# Altium schematic sheet TOP.SchDoc
size 420 x 297 mm; Date: 22.03.2024; ApprovedBy: Arda B.; CheckedBy: Arda B.; DrawnBy: Arda Bozkurt; Revision: 001; SheetNumber: 3; SheetTotal: 9; Size: A3; Department: HDD; DOC_NO_ASSY_: __; Time: 22.03.2024
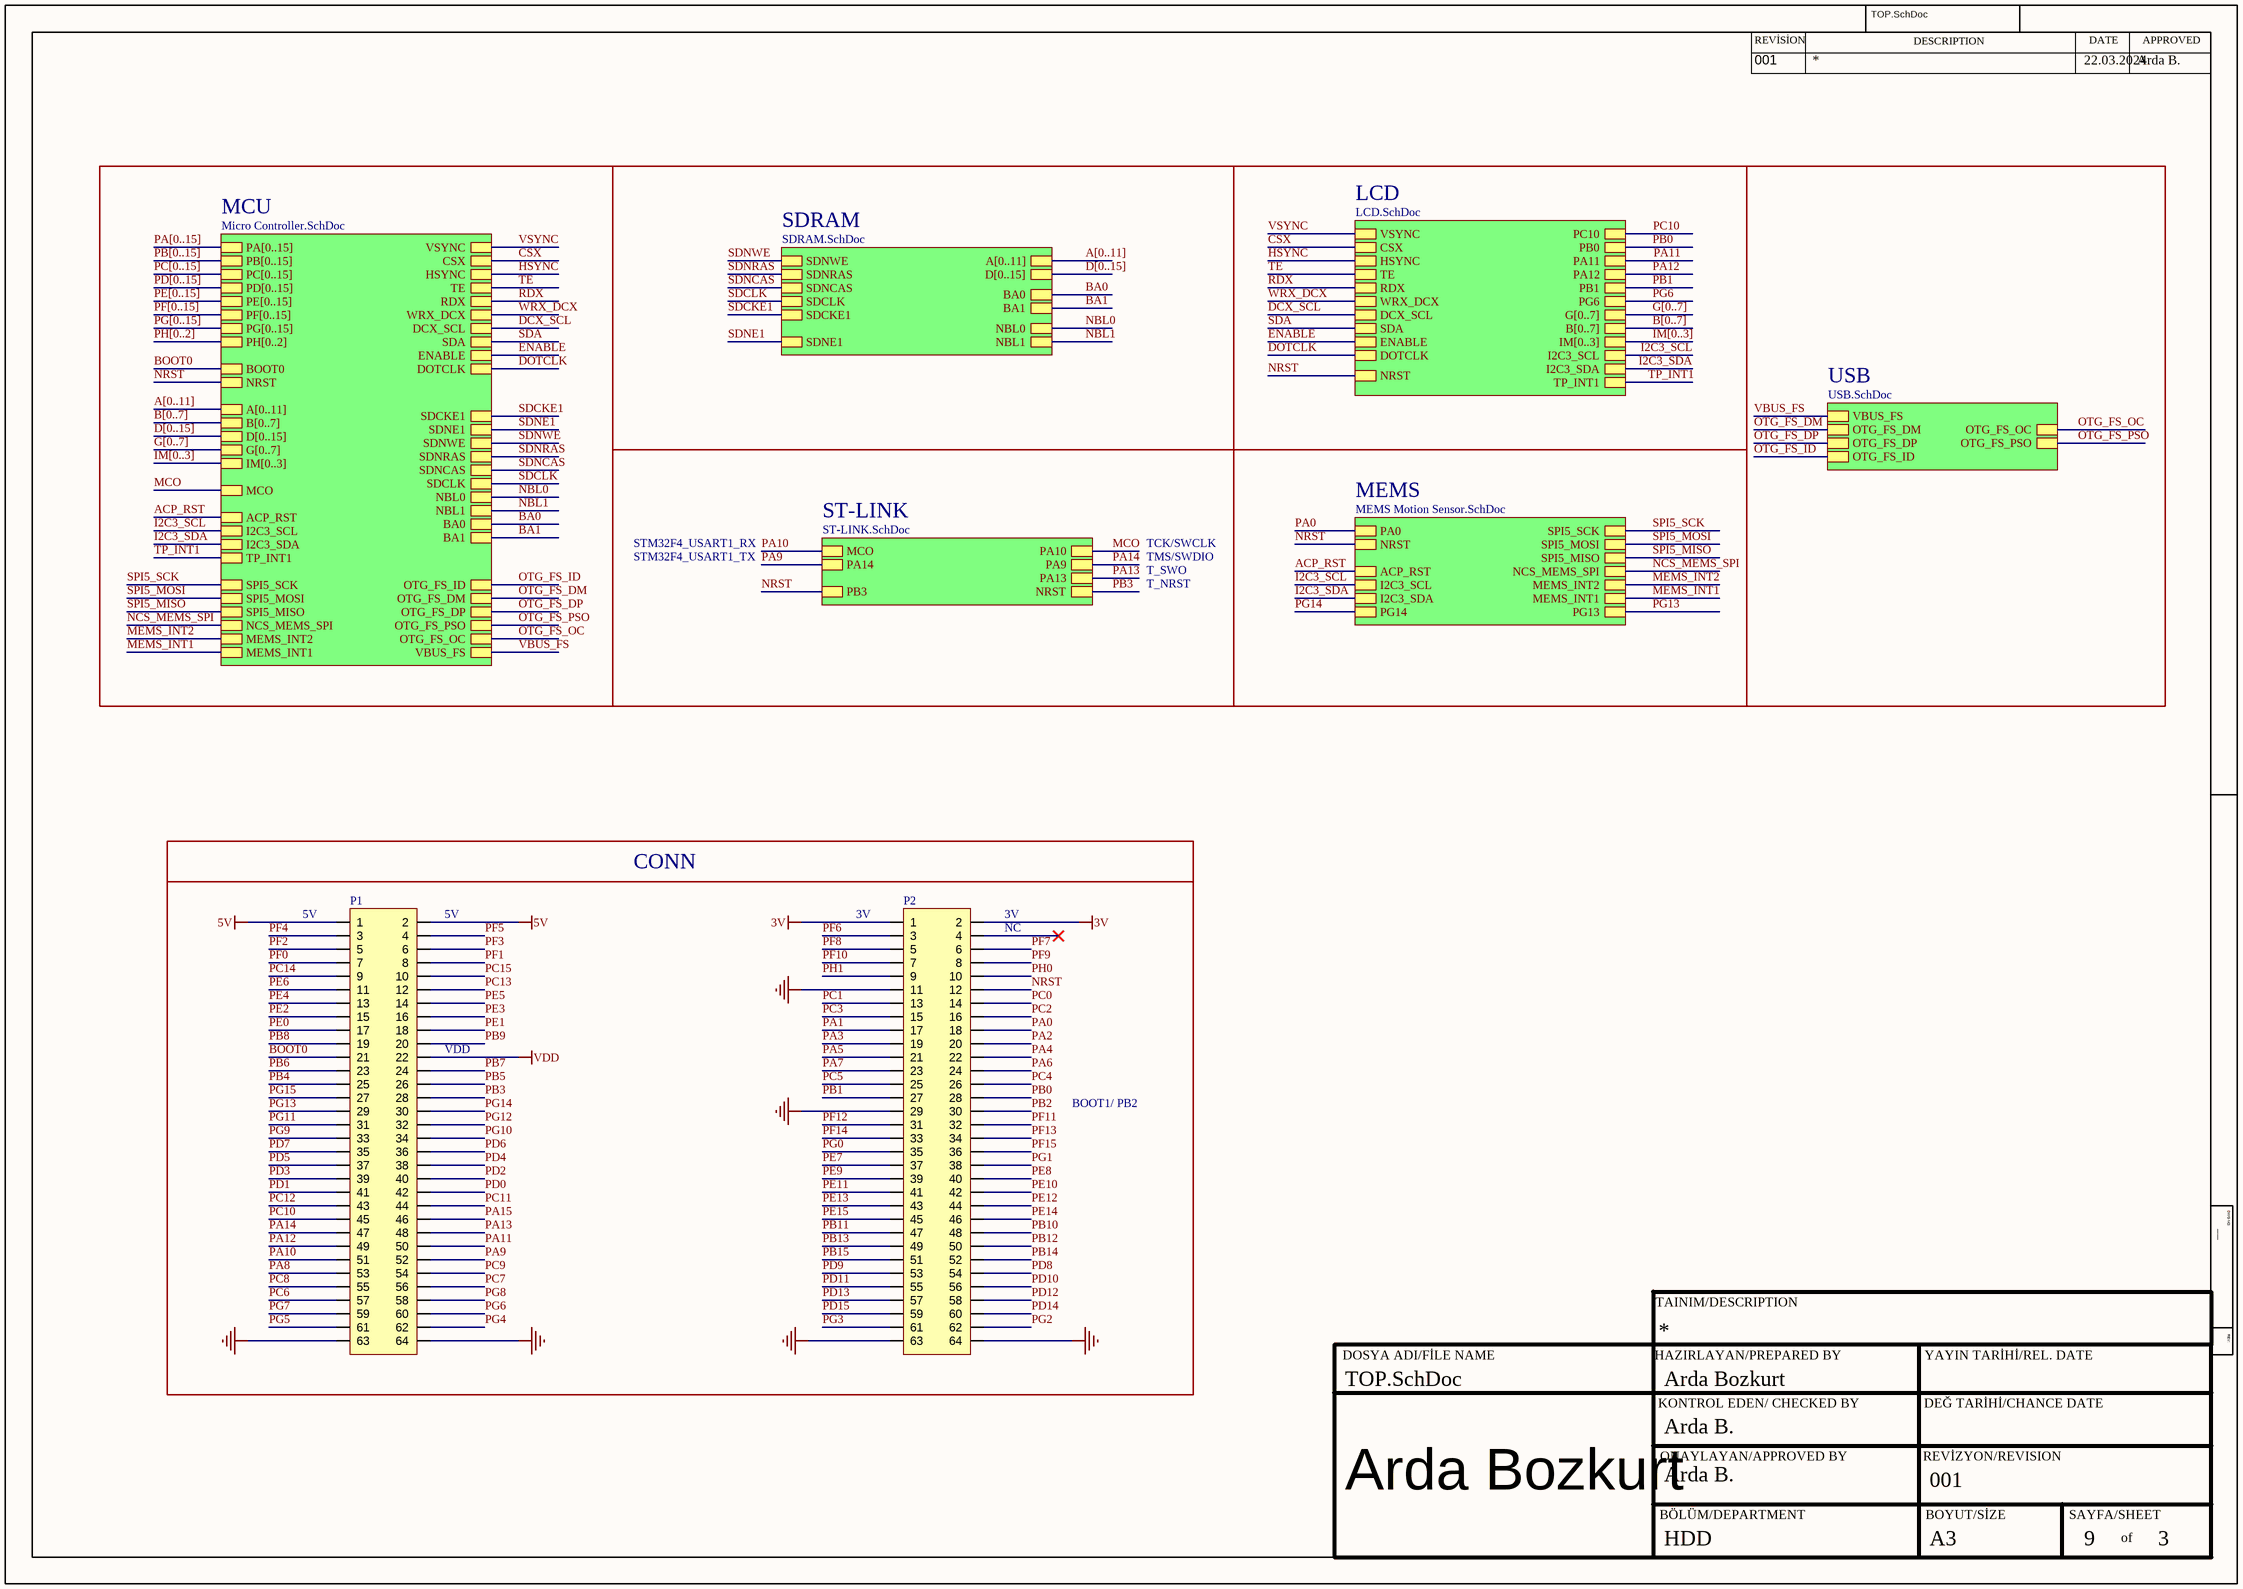
[diagram p0: TOP.SchDoc]

## Parts
P1  TSW-132-24-T-D  [CONN-2*32POS]  (value not drawn)
P2  TSW-132-24-T-D  [CONN-2*32POS]  (value not drawn)

## Blocks framed on the sheet
CONN: P1 P2

## Sub-sheets
LCD = LCD.SchDoc: PC10, PB0, PA11, PA12, PB1, PG6, G[0..7], B[0..7], IM[0..3], I2C3_SCL, I2C3_SDA, TP_INT1, NRST, VSYNC, CSX, HSYNC, TE, RDX, WRX_DCX, DCX_SCL, SDA, ENABLE, DOTCLK
MCU = Micro Controller.SchDoc: PA[0..15], PB[0..15], PC[0..15], PD[0..15], PE[0..15], PF[0..15], PG[0..15], PH[0..2], BOOT0, NRST, A[0..11], B[0..7], D[0..15], G[0..7], IM[0..3], MCO, ACP_RST, I2C3_SCL, I2C3_SDA, TP_INT1, VSYNC, CSX, HSYNC, TE, RDX, WRX_DCX, DCX_SCL, SDA, ENABLE, DOTCLK, SDCKE1, SDNE1, SDNWE, SDNRAS, SDNCAS, SDCLK, NBL0, NBL1, BA0, BA1, OTG_FS_ID, OTG_FS_DM, OTG_FS_DP, OTG_FS_PSO, OTG_FS_OC, VBUS_FS, SPI5_SCK, SPI5_MOSI, SPI5_MISO, NCS_MEMS_SPI, MEMS_INT2, MEMS_INT1
MEMS = MEMS Motion Sensor.SchDoc: PG13, PA0, NRST, PG14, SPI5_SCK, SPI5_MOSI, SPI5_MISO, NCS_MEMS_SPI, MEMS_INT2, MEMS_INT1, ACP_RST, I2C3_SCL, I2C3_SDA
SDRAM = SDRAM.SchDoc: SDCKE1, SDNE1, SDNWE, SDNRAS, SDNCAS, SDCLK, NBL0, NBL1, BA0, BA1, A[0..11], D[0..15]
ST-LINK = ST-LINK.SchDoc: PA10, PA9, MCO, PA14, PA13, PB3, NRST
USB = USB.SchDoc: VBUS_FS, OTG_FS_DM, OTG_FS_DP, OTG_FS_ID, OTG_FS_OC, OTG_FS_PSO

## Nets
3V: P2.1 P2.2
5V: P1.1 P1.2
GND: P1.63 P1.64 P2.11 P2.29 P2.63 P2.64
VDD: P1.22
ACP_RST: sheet MCU/ACP_RST, sheet MEMS/ACP_RST
BA0: sheet MCU/BA0, sheet SDRAM/BA0
BA1: sheet MCU/BA1, sheet SDRAM/BA1
BOOT0: P1.21 ; sheet MCU/BOOT0
CSX: sheet MCU/CSX, sheet LCD/CSX
DCX_SCL: sheet MCU/DCX_SCL, sheet LCD/DCX_SCL
DOTCLK: sheet MCU/DOTCLK, sheet LCD/DOTCLK
ENABLE: sheet MCU/ENABLE, sheet LCD/ENABLE
HSYNC: sheet MCU/HSYNC, sheet LCD/HSYNC
I2C3_SCL: sheet MCU/I2C3_SCL, sheet LCD/I2C3_SCL, sheet MEMS/I2C3_SCL
I2C3_SDA: sheet MCU/I2C3_SDA, sheet LCD/I2C3_SDA, sheet MEMS/I2C3_SDA
MCO: sheet MCU/MCO, sheet ST-LINK/PA10
MEMS_INT1: sheet MCU/MEMS_INT1, sheet MEMS/MEMS_INT1
MEMS_INT2: sheet MCU/MEMS_INT2, sheet MEMS/MEMS_INT2
NBL0: sheet MCU/NBL0, sheet SDRAM/NBL0
NBL1: sheet MCU/NBL1, sheet SDRAM/NBL1
NCS_MEMS_SPI: sheet MCU/NCS_MEMS_SPI, sheet MEMS/NCS_MEMS_SPI
NRST: P2.12 ; sheet MCU/NRST, sheet ST-LINK/PB3, sheet LCD/NRST, sheet MEMS/NRST
OTG_FS_DM: sheet MCU/OTG_FS_DM, sheet USB/OTG_FS_DM
OTG_FS_DP: sheet MCU/OTG_FS_DP, sheet USB/OTG_FS_DP
OTG_FS_ID: sheet MCU/OTG_FS_ID, sheet USB/OTG_FS_ID
OTG_FS_OC: sheet MCU/OTG_FS_OC, sheet USB/OTG_FS_OC
OTG_FS_PSO: sheet MCU/OTG_FS_PSO, sheet USB/OTG_FS_PSO
PA0: P2.18 ; sheet MEMS/PA0
PA1: P2.17
PA2: P2.20
PA3: P2.19
PA4: P2.22
PA5: P2.21
PA6: P2.24
PA7: P2.23
PA8: P1.53
PA9: P1.52 ; sheet ST-LINK/PA14
PA10: P1.51 ; sheet ST-LINK/MCO
PA11: P1.50 ; sheet LCD/PA11
PA12: P1.49 ; sheet LCD/PA12
PA13: P1.48 ; sheet ST-LINK/PA13
PA14: P1.47 ; sheet ST-LINK/PA9
PA15: P1.46
PB0: P2.28 ; sheet LCD/PB0
PB1: P2.27 ; sheet LCD/PB1
PB2: P2.30
PB3: P1.28 ; sheet ST-LINK/NRST
PB4: P1.25
PB5: P1.26
PB6: P1.23
PB7: P1.24
PB8: P1.19
PB9: P1.20
PB10: P2.48
PB11: P2.47
PB12: P2.50
PB13: P2.49
PB14: P2.52
PB15: P2.51
PC0: P2.14
PC1: P2.13
PC2: P2.16
PC3: P2.15
PC4: P2.26
PC5: P2.25
PC6: P1.57
PC7: P1.56
PC8: P1.55
PC9: P1.54
PC10: P1.45 ; sheet LCD/PC10
PC11: P1.44
PC12: P1.43
PC13: P1.12
PC14: P1.9
PC15: P1.10
PD0: P1.42
PD1: P1.41
PD2: P1.40
PD3: P1.39
PD4: P1.38
PD5: P1.37
PD6: P1.36
PD7: P1.35
PD8: P2.54
PD9: P2.53
PD10: P2.56
PD11: P2.55
PD12: P2.58
PD13: P2.57
PD14: P2.60
PD15: P2.59
PE0: P1.17
PE1: P1.18
PE2: P1.15
PE3: P1.16
PE4: P1.13
PE5: P1.14
PE6: P1.11
PE7: P2.37
PE8: P2.40
PE9: P2.39
PE10: P2.42
PE11: P2.41
PE12: P2.44
PE13: P2.43
PE14: P2.46
PE15: P2.45
PF0: P1.7
PF1: P1.8
PF2: P1.5
PF3: P1.6
PF4: P1.3
PF5: P1.4
PF6: P2.3
PF7: P2.6
PF8: P2.5
PF9: P2.8
PF10: P2.7
PF11: P2.32
PF12: P2.31
PF13: P2.34
PF14: P2.33
PF15: P2.36
PG0: P2.35
PG1: P2.38
PG2: P2.62
PG3: P2.61
PG4: P1.62
PG5: P1.61
PG6: P1.60 ; sheet LCD/PG6
PG7: P1.59
PG8: P1.58
PG9: P1.33
PG10: P1.34
PG11: P1.31
PG12: P1.32
PG13: P1.29 ; sheet MEMS/PG13
PG14: P1.30 ; sheet MEMS/PG14
PG15: P1.27
PH0: P2.10
PH1: P2.9
RDX: sheet MCU/RDX, sheet LCD/RDX
SDA: sheet MCU/SDA, sheet LCD/SDA
SDCKE1: sheet MCU/SDCKE1, sheet SDRAM/SDCKE1
SDCLK: sheet MCU/SDCLK, sheet SDRAM/SDCLK
SDNCAS: sheet MCU/SDNCAS, sheet SDRAM/SDNCAS
SDNE1: sheet MCU/SDNE1, sheet SDRAM/SDNE1
SDNRAS: sheet MCU/SDNRAS, sheet SDRAM/SDNRAS
SDNWE: sheet MCU/SDNWE, sheet SDRAM/SDNWE
SPI5_MISO: sheet MCU/SPI5_MISO, sheet MEMS/SPI5_MISO
SPI5_MOSI: sheet MCU/SPI5_MOSI, sheet MEMS/SPI5_MOSI
SPI5_SCK: sheet MCU/SPI5_SCK, sheet MEMS/SPI5_SCK
TE: sheet MCU/TE, sheet LCD/TE
TP_INT1: sheet MCU/TP_INT1, sheet LCD/TP_INT1
VBUS_FS: sheet MCU/VBUS_FS, sheet USB/VBUS_FS
VSYNC: sheet MCU/VSYNC, sheet LCD/VSYNC
WRX_DCX: sheet MCU/WRX_DCX, sheet LCD/WRX_DCX

Not connected (* = marked no-connect by the designer): P2 4*

## Buses and harness runs
bus A[0..11] = sheet MCU/A[0..11]
bus A[0..11] = sheet SDRAM/A[0..11]
bus B[0..7] = sheet LCD/B[0..7]
bus B[0..7] = sheet MCU/B[0..7]
bus D[0..15] = sheet MCU/D[0..15]
bus D[0..15] = sheet SDRAM/D[0..15]
bus G[0..7] = sheet LCD/G[0..7]
bus G[0..7] = sheet MCU/G[0..7]
bus IM[0..3] = sheet LCD/IM[0..3]
bus IM[0..3] = sheet MCU/IM[0..3]
bus PA[0..15] = sheet MCU/PA[0..15]
bus PB[0..15] = sheet MCU/PB[0..15]
bus PC[0..15] = sheet MCU/PC[0..15]
bus PD[0..15] = sheet MCU/PD[0..15]
bus PE[0..15] = sheet MCU/PE[0..15]
bus PF[0..15] = sheet MCU/PF[0..15]
bus PG[0..15] = sheet MCU/PG[0..15]
bus PH[0..2] = sheet MCU/PH[0..2]

## Notes on the sheet
- STM32F4_USART1_TX
- STM32F4_USART1_RX
- TCK/SWCLK
- TMS/SWDIO
- T_SWO
- T_NRST
- (near P1) 5V
- (near P2) 3V
- (near P2) NC
- (near P1) VDD
- BOOT1/ PB2
- REVİSİON
- DESCRIPTION
- DATE
- APPROVED
- DWG NO:
- TAINIM/DESCRIPTION
- REV:
- DOSYA ADI/FİLE NAME
- HAZIRLAYAN/PREPARED BY
- KONTROL EDEN/ CHECKED BY
- YAYIN TARİHİ/REL. DATE
- DEĞ TARİHİ/CHANCE DATE
- ONAYLAYAN/APPROVED BY
- REVİZYON/REVISION
- Arda Bozkurt
- BÖLÜM/DEPARTMENT
- BOYUT/SİZE
- SAYFA/SHEET
- of

## Library data of the parts
P1 P2 = CONN HEADER VERT 32POS 2.54MM: Headers & Wire Housings Classic PCB Header Strips, 0.100 pitch; Manufacturer: Wurth Electronics; Manufacturer Part Number: 61303221121; Operating Supply Voltage: 250V; Contact Resistance: 20mR; Current Rating: 3A; Gender: 29Gender; Supplier: Farnell; Supplier Part Number: 2356145; RoHS: Yes; Category: Connectors; Stock: 745; Pricing: 1=1,75, 10=0,941, 100=0,855, 500=0,778, 1000=0,762, 2500=0,747 (EUR); Orientation: 5495OrientationType; ComponentLink1URL: https://datasheet.ciiva.com/28505/1442180-28505766.pdf?src-supplier=Element14; ComponentLink1Description: https://datasheet.ciiva.com/28505/1442180-28505766.pdf?src-supplier=Element14; ComponentLink2URL: https://datasheet.ciiva.com/48557/htsw-th-48557319.pdf?src-supplier=Avnet; ComponentLink2Description: https://datasheet.ciiva.com/48557/htsw-th-48557319.pdf?src-supplier=Avnet